# Altium schematic sheet gatedriver_interface.SchDoc
size A4
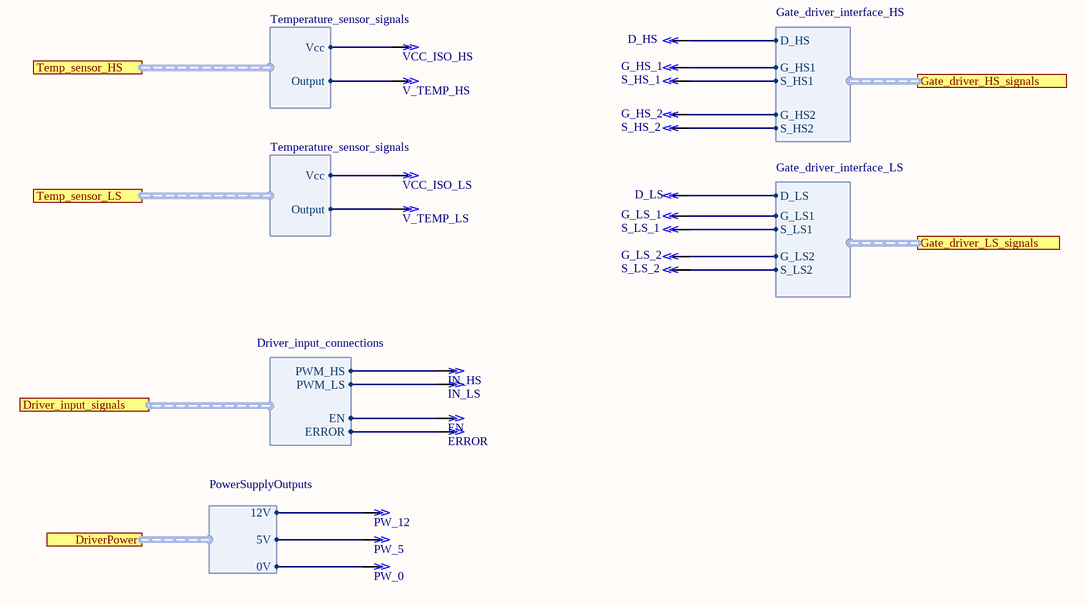
[diagram p0: gatedriver_interface.SchDoc]

## Parts
D_HS  Board interconection  [Single pad - Right Angle 2]  (value not drawn)
D_LS  Board interconection  [Single pad - Right Angle 2]  (value not drawn)
EN  Board interconection  [Single pad - Right Angle 2]  (value not drawn)
ERROR  Board interconection  [Single pad - Right Angle 2]  (value not drawn)
G_HS_1  Board interconection  [Single pad - Right Angle 2]  (value not drawn)
G_HS_2  Board interconection  [Single pad - Right Angle 2]  (value not drawn)
G_LS_1  Board interconection  [Single pad - Right Angle 2]  (value not drawn)
G_LS_2  Board interconection  [Single pad - Right Angle 2]  (value not drawn)
IN_HS  Board interconection  [Single pad - Right Angle 2]  (value not drawn)
IN_LS  Board interconection  [Single pad - Right Angle 2]  (value not drawn)
PW_0  Board interconection  [Single pad - Right Angle 2]  (value not drawn)
PW_5  Board interconection  [Single pad - Right Angle 2]  (value not drawn)
PW_12  Board interconection  [Single pad - Right Angle 2]  (value not drawn)
S_HS_1  Board interconection  [Single pad - Right Angle 2]  (value not drawn)
S_HS_2  Board interconection  [Single pad - Right Angle 2]  (value not drawn)
S_LS_1  Board interconection  [Single pad - Right Angle 2]  (value not drawn)
S_LS_2  Board interconection  [Single pad - Right Angle 2]  (value not drawn)
V_TEMP_HS  Board interconection  [Single pad - Right Angle 2]  (value not drawn)
V_TEMP_LS  Board interconection  [Single pad - Right Angle 2]  (value not drawn)
VCC_ISO_HS  Board interconection  [Single pad - Right Angle 2]  (value not drawn)
VCC_ISO_LS  Board interconection  [Single pad - Right Angle 2]  (value not drawn)

## Ports
Driver_input_signals (harness Driver_input_connections), DriverPower (harness PowerSupplyOutputs), Gate_driver_HS_signals (harness Gate_driver_interface_HS), Gate_driver_LS_signals (harness Gate_driver_interface_LS), Temp_sensor_HS (harness Temperature_sensor_signals), Temp_sensor_LS (harness Temperature_sensor_signals)

## Harnesses
Driver_input_connections: PWM_HS, PWM_LS, EN, ERROR
Gate_driver_interface_HS: D_HS, G_HS1, G_HS2, S_HS1, S_HS2
Gate_driver_interface_LS: D_LS, G_LS1, G_LS2, S_LS1, S_LS2
PowerSupplyOutputs: 0V, 12V, 5V
Temperature_sensor_signals: Output, Vcc

## Nets
NetD_HS_1: D_HS.1 ; port Gate_driver_HS_signals.D_HS
NetD_LS_1: D_LS.1 ; port Gate_driver_LS_signals.D_LS
NetEN_1: EN.1 ; port Driver_input_signals.EN
NetERROR_1: ERROR.1 ; port Driver_input_signals.ERROR
NetG_HS_1_1: G_HS_1.1 ; port Gate_driver_HS_signals.G_HS1
NetG_HS_2_1: G_HS_2.1 ; port Gate_driver_HS_signals.G_HS2
NetG_LS_1_1: G_LS_1.1 ; port Gate_driver_LS_signals.G_LS1
NetG_LS_2_1: G_LS_2.1 ; port Gate_driver_LS_signals.G_LS2
NetIN_HS_1: IN_HS.1 ; port Driver_input_signals.PWM_HS
NetIN_LS_1: IN_LS.1 ; port Driver_input_signals.PWM_LS
NetPW_0_1: PW_0.1 ; port DriverPower.0V
NetPW_5_1: PW_5.1 ; port DriverPower.5V
NetPW_12_1: PW_12.1 ; port DriverPower.12V
NetS_HS_1_1: S_HS_1.1 ; port Gate_driver_HS_signals.S_HS1
NetS_HS_2_1: S_HS_2.1 ; port Gate_driver_HS_signals.S_HS2
NetS_LS_1_1: S_LS_1.1 ; port Gate_driver_LS_signals.S_LS1
NetS_LS_2_1: S_LS_2.1 ; port Gate_driver_LS_signals.S_LS2
NetV_TEMP_HS_1: V_TEMP_HS.1 ; port Temp_sensor_HS.Output
NetV_TEMP_LS_1: V_TEMP_LS.1 ; port Temp_sensor_LS.Output
NetVCC_ISO_HS_1: VCC_ISO_HS.1 ; port Temp_sensor_HS.Vcc
NetVCC_ISO_LS_1: VCC_ISO_LS.1 ; port Temp_sensor_LS.Vcc

## Notes on the sheet
- Title
- Size:
- Date:
- A4
- Number:
- Time:
- Revision:
- Sheet
- of
- Author
- Organization
- File:

## Library data of the parts
D_HS D_LS EN ERROR G_HS_1 G_HS_2 G_LS_1 G_LS_2 IN_HS IN_LS PW_0 PW_5 PW_12 S_HS_1 S_HS_2 S_LS_1 S_LS_2 V_TEMP_HS V_TEMP_LS VCC_ISO_HS VCC_ISO_LS = Board interconection: Interconection between gatedriver and main board; Value: Male Header 1 pin - 90 degrees; pn: *
  S_HS_1 S_HS_2 S_LS_1 S_LS_2: ClassName: Direct_plane_connect